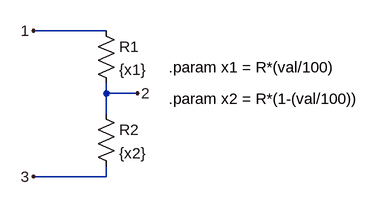
[diagram p0: schematic pot.asc]
pot.asc, the LTspice schematic file:
Version 4
SHEET 1 880 680
WIRE 64 32 -48 32
WIRE 64 128 64 112
WIRE 112 128 64 128
WIRE 64 160 64 128
WIRE 64 256 64 240
WIRE 64 256 -48 256
FLAG -48 32 1
FLAG 112 128 2
FLAG -48 256 3
SYMBOL res 48 16 R0
SYMATTR InstName R1
SYMATTR Value {x1}
SYMBOL res 48 144 R0
SYMATTR InstName R2
SYMATTR Value {x2}
TEXT 160 88 Left 2 !.param x1 = R*(val/100)
TEXT 160 136 Left 2 !.param x2 = R*(1-(val/100))

The netlist it stands for:
* pot.asc
R1 1 2 {x1}
R2 2 3 {x2}
.param x1 = R*(val/100)
.param x2 = R*(1-(val/100))
.backanno
.end